# EasyEDA Pro project ProPrj_辉光管_2024.2.16_2024-11-09.epro, board PCB1
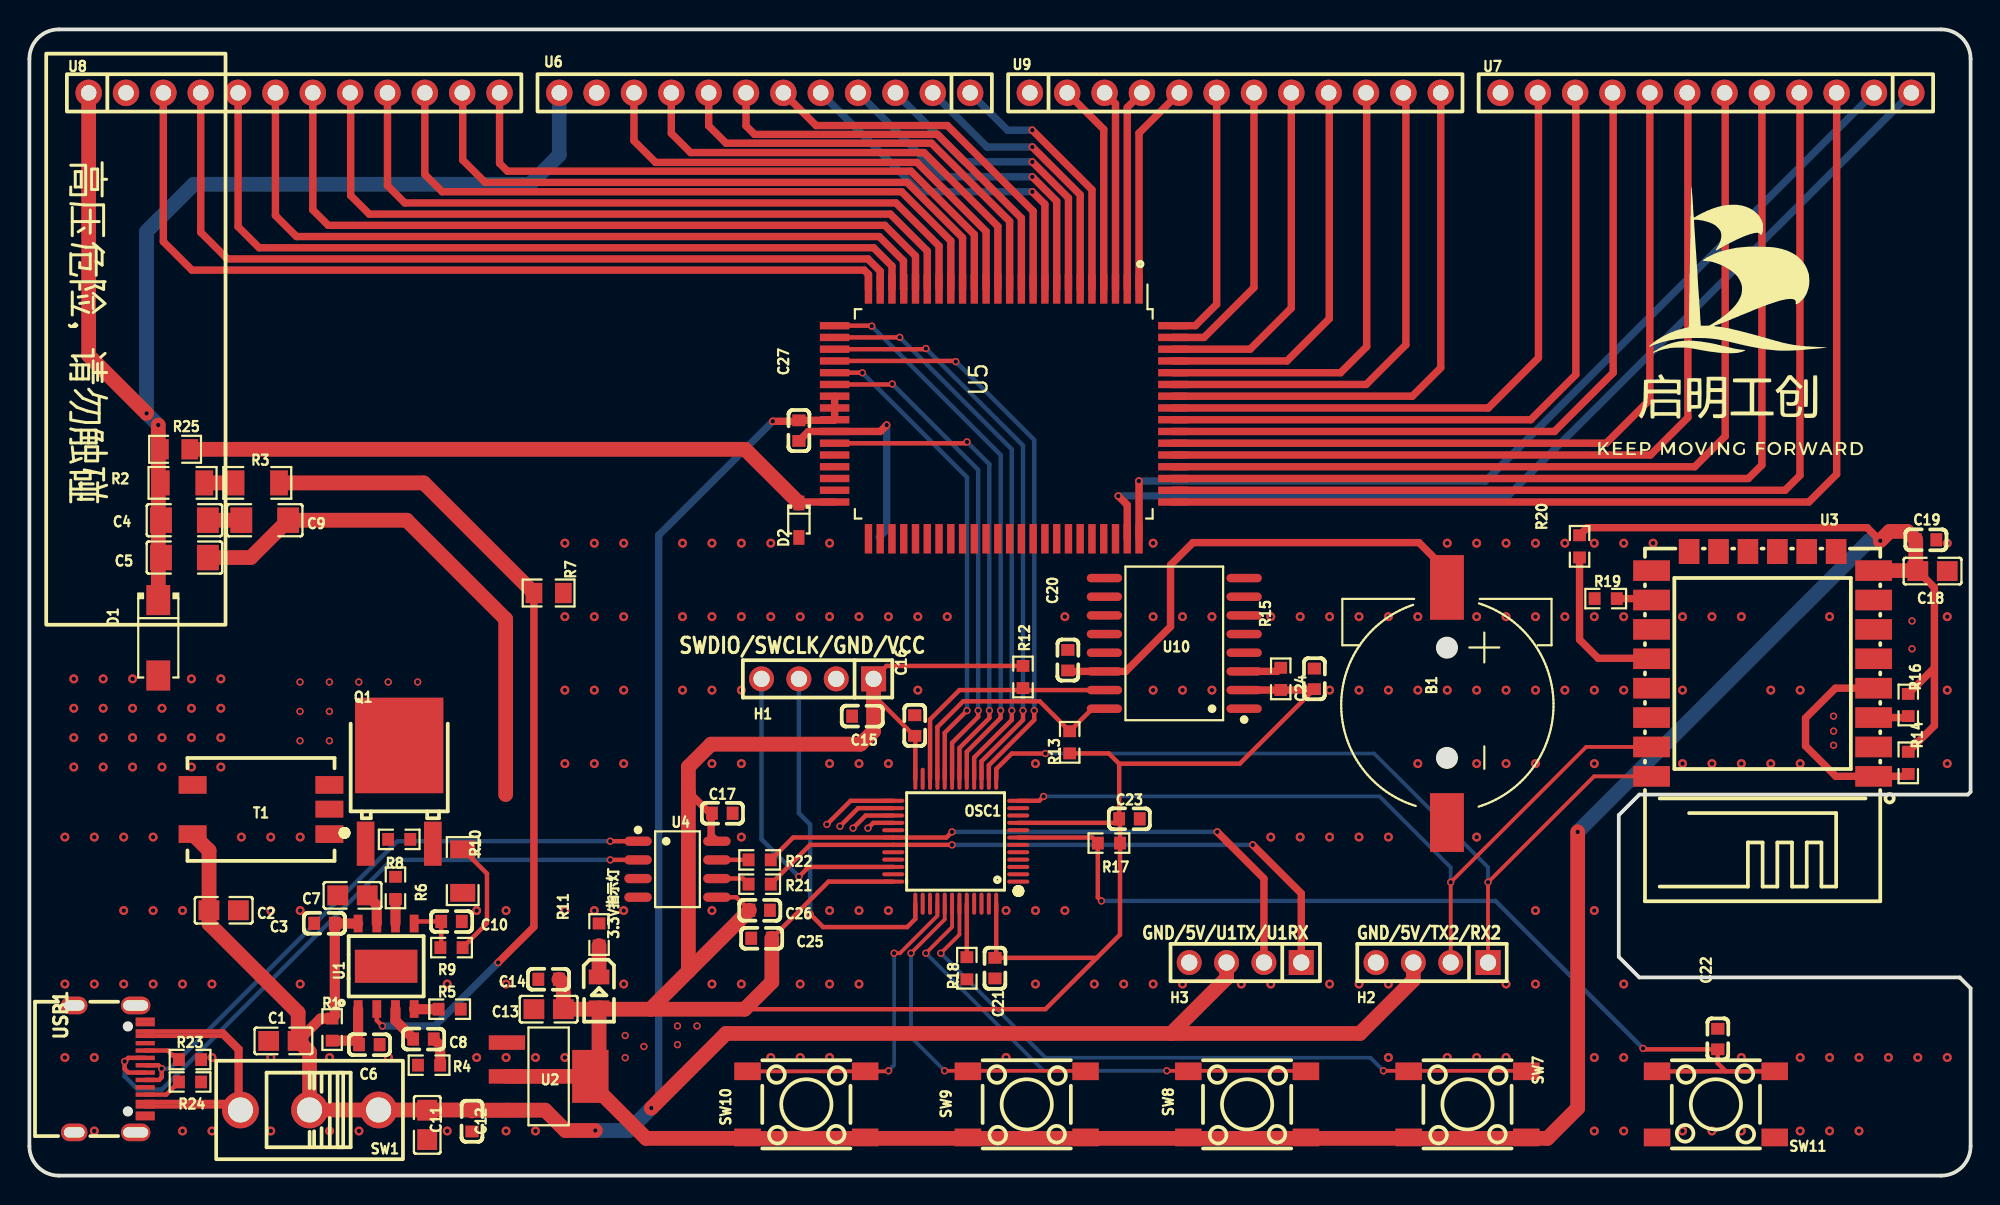
[diagram p0: board, top side]
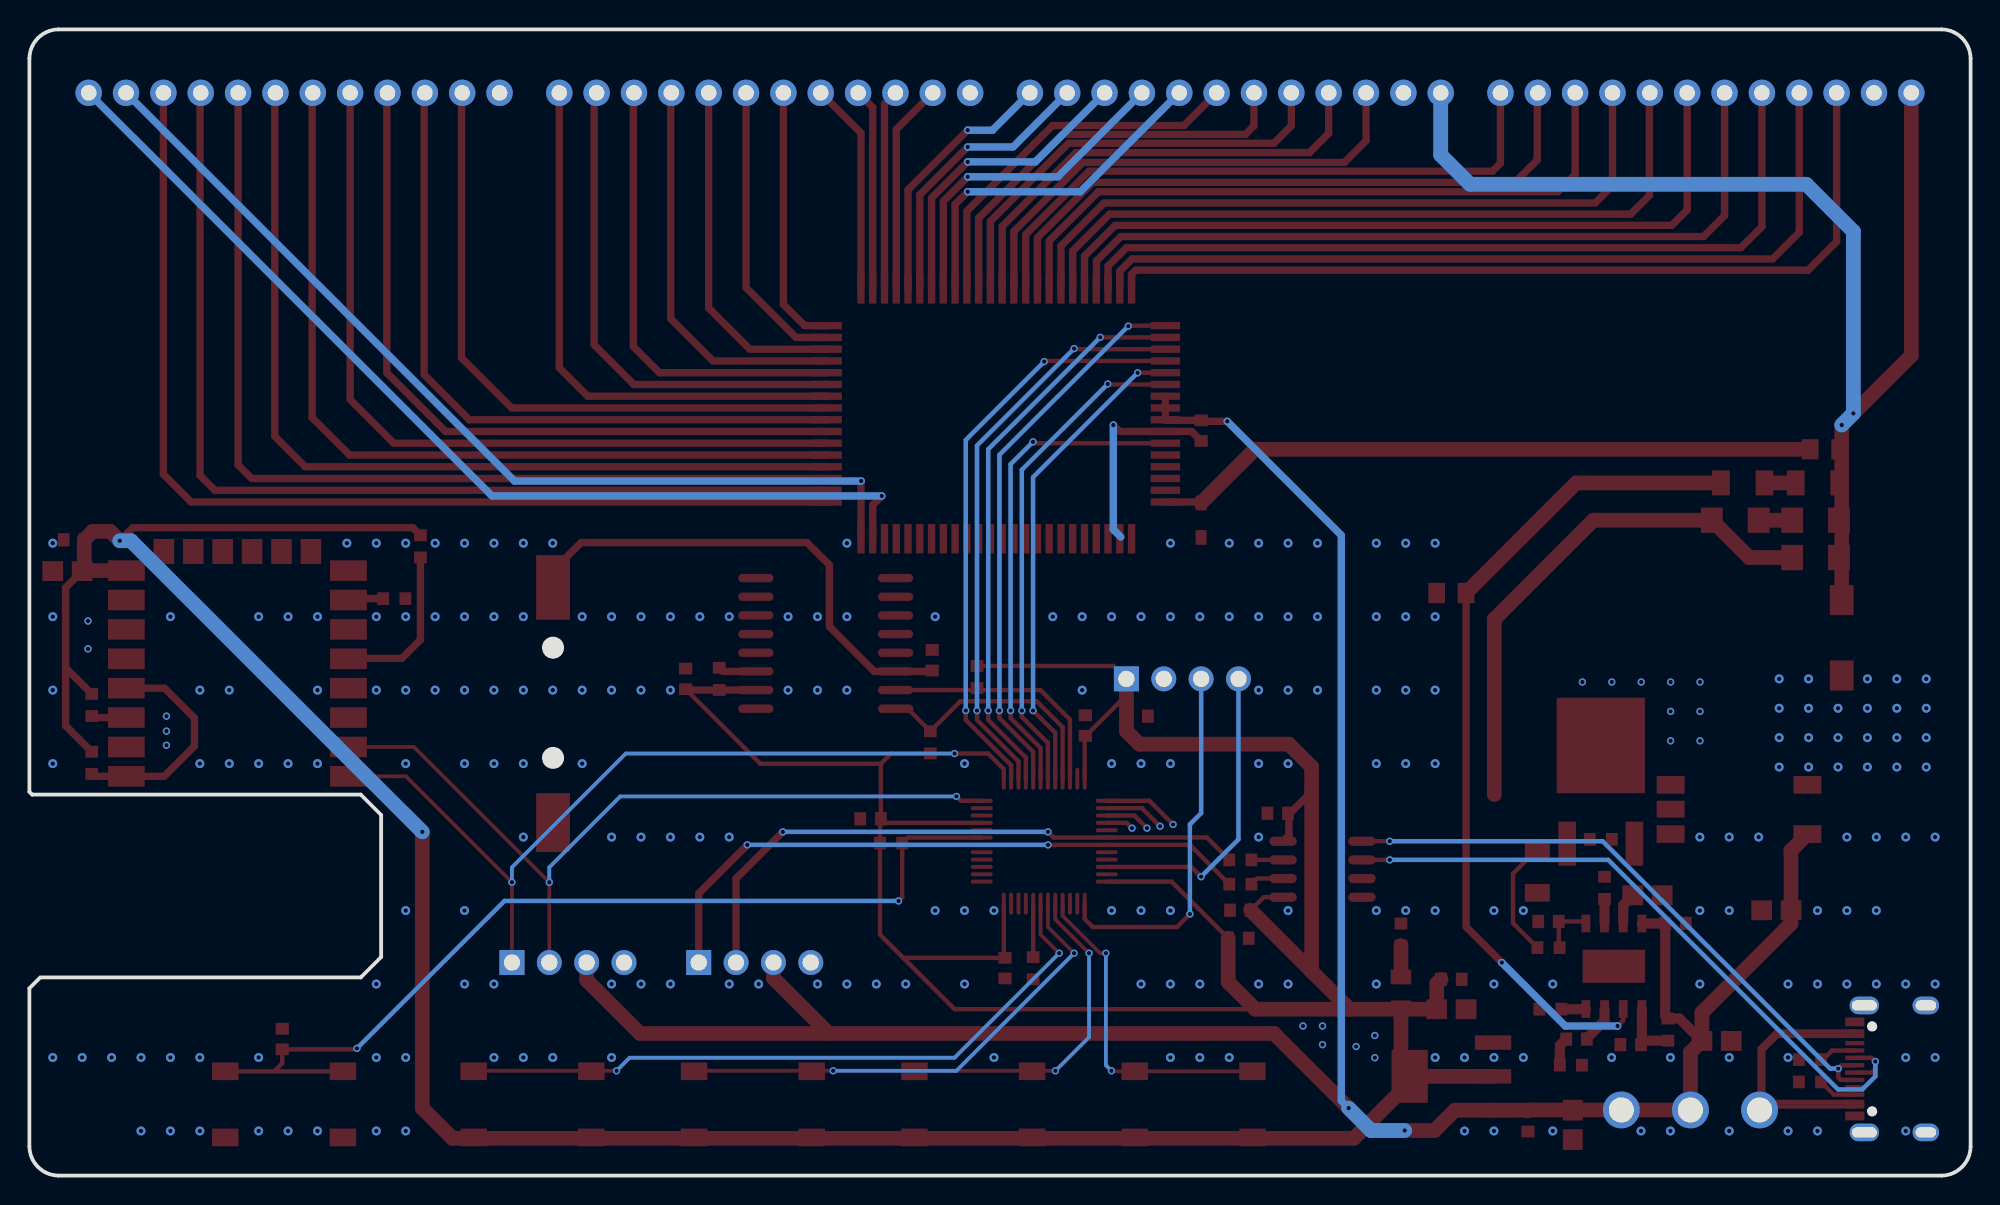
[diagram p1: board, bottom side, seen from below]

Outline 132 x 78 mm; copper layers: Top Layer, Bottom Layer. Coordinates in mm from the lower left corner of the outline.
Outline path: 0,76 0,2 arc(0.59,0.59) 2,0 130,0 arc(131.41,0.59) 132,2 132,12.75 131.26,13.48 109.47,13.48 108.08,14.88 108.08,24.53 109.47,25.93 131.82,25.93 132,26.11 132,76 arc(131.41,77.41) 130,78 2,78 arc(0.59,77.41) 0,76
Stack: Top Layer 0.035mm / Dielectric1 1.51mm FR4 er 4.5 / Bottom Layer 0.035mm

## Design rules (mm)
template: 自定义配置
spacing copperThickness1oz (default): track to track 0.102, other pairs 0.152 to 0.3
spacing copperThickness2oz: track to track 0.203, other pairs 0.152 to 0.3
track width copperThickness1oz (default): min 0.127, default 0.254, max 2.54
track width copperThickness2oz: min 0.203, default 0.254, max 2.54
differential pair differentialPair (default): width min 0.127, default 0.254, max 2.54; gap min 0.152, default 0.152
via viaSize (default): diameter min 0.5, default 0.61, max 10; hole min 0.3, default 0.305, max 6.3

## Placement (name value [footprint] x y rotation side)
3.3V指示灯  NCD0805R1  [LED0805-R-RD]  38.73 12.47 270 top
B1  CR1220-2  [BAT-SMD_CR1220-2]  96.39 32.03 270 top
C1  10uF  [C0805]  17.27 9.17 0 top
C2  10uF  [C0805]  13.21 18.06 180 top
C3  100nF  [C0603]  20.07 17.17 0 top
C4  1uF  [C1206]  10.54 44.6 180 top
C5  100nF  [C1206]  10.54 42.06 180 top
C6  100nF  [C0603]  23.11 8.91 180 top
C7  10uF  [C0805]  21.97 19.07 180 top
C8  10nF  [C0603]  26.8 9.29 180 top
C9  1uF  [C1206]  16 44.6 180 top
C10  100nF  [C0603]  28.7 17.29 180 top
C11  10uF  [C0805]  27.05 3.45 90 top
C12  100nF  [C0603]  30.1 3.71 90 top
C13  10uF  [C0805]  35.31 11.32 0 top
C14  100nF  [C0603]  35.31 13.36 0 top
C15  100nF  [C0603]  56.64 31.26 0 top
C16  100nF  [C0603]  60.2 30.63 270 top
C17  100nF  [C0603]  47.12 24.66 180 top
C18  10uF  [C0805]  129.41 41.14 180 top
C19  100nF  [C0603]  128.97 43.26 0 top
C20  100nF  [C0603]  70.61 35.07 270 top
C21  100nF  [C0603]  65.66 14.12 90 top
C22  1uF  [C0603]  114.81 9.29 270 top
C23  100nF  [C0603]  74.8 24.28 0 top
C24  100nF  [C0603]  87.38 33.8 270 top
C25  100nF  [C0603]  49.78 16.15 180 top
C26  100nF  [C0603]  49.66 18.06 180 top
C27  100nF  [C0603]  52.32 50.69 270 top
D1  ES1J  [SMA_L4.4-W2.8-LS5.4-RD]  8.76 36.6 270 top
D2  MM3Z68  [SOD-323_L1.8-W1.3-LS2.5-RD-1]  52.32 44.6 270 top
H1  PZ254V-11-04P  [HDR-TH_4P-P2.54-V-M]  53.59 33.8 180 top
H2  PZ254V-11-04P  [HDR-TH_4P-P2.54-V-M]  95.38 14.5 180 top
H3  PZ254V-11-04P  [HDR-TH_4P-P2.54-V-M]  82.68 14.5 180 top
OSC1  STM32F103C8T6TR  [LQFP-48_L7.0-W7.0-P0.50-LS9.0-BL]  62.99 22.75 90 top
Q1  NCEP02515K  [TO-252-3_L6.6-W6.1-P4.58-LS10.1-BR-2]  25.15 25.93 270 top
R1  10kΩ  [R0603]  20.58 9.94 90 top
R2  100kΩ  [R1206]  10.41 47.14 0 top
R3  100kΩ  [R1206]  15.49 47.14 0 top
R4  10kΩ  [R0603]  27.18 7.51 0 top
R5  20kΩ  [R0603]  28.58 11.32 180 top
R6  0Ω  [R0603]  24.89 19.58 90 top
R7  1.5kΩ  [R0805]  35.31 39.65 180 top
R8  10kΩ  [R0603]  25.15 22.88 180 top
R9  20Ω  [R0603]  28.7 15.52 0 top
R10  100mΩ  [R1206]  29.46 20.72 90 top
R11  1kΩ  [R0603]  38.73 16.41 270 top
R12  10kΩ  [R0603]  67.56 33.93 90 top
R13  10kΩ  [R0603]  70.74 29.49 270 top
R14  10kΩ  [R0603]  127.76 28.09 90 top
R15  10kΩ  [R0603]  85.09 33.8 90 top
R16  10kΩ  [R0603]  127.76 32.03 90 top
R17  10kΩ  [R0603]  73.41 22.63 180 top
R18  10kΩ  [R0603]  63.75 14.11 90 top
R19  10kΩ  [R0603]  107.19 39.27 180 top
R20  10kΩ  [R0603]  105.41 42.82 270 top
R21  0Ω  [R0603]  49.66 19.83 0 top
R22  0Ω  [R0603]  49.66 21.48 0 top
R23  1kΩ  [R0603]  10.92 7.9 0 top
R24  1kΩ  [R0603]  10.92 6.37 0 top
R25  240kΩ  [R0805]  9.91 49.42 180 top
SW1  SS-12D10L3  [SW-TH_SS-12D10L3]  19.05 4.47 180 top
SW7  TS-1102S-B-A-B  [SW-SMD_4P-L6.0-W6.0-P4.50-LS8.6]  97.79 4.85 0 top
SW8  TS-1102S-B-A-B  [SW-SMD_4P-L6.0-W6.0-P4.50-LS8.6]  82.8 4.85 0 top
SW9  TS-1102S-B-A-B  [SW-SMD_4P-L6.0-W6.0-P4.50-LS8.6]  67.82 4.85 0 top
SW10  TS-1102S-B-A-B  [SW-SMD_4P-L6.0-W6.0-P4.50-LS8.6]  52.83 4.85 0 top
SW11  TS-1102S-B-A-B  [SW-SMD_4P-L6.0-W6.0-P4.50-LS8.6]  114.68 4.85 180 top
T1  TTRN-060S-013-T  [TTRN-060S-013]  15.75 24.91 90 top
U1  -  [ESOP-8_L4.9-W3.9-P1.27-LS6.0-BL-EP4.2]  24.26 14.25 0 top
U2  AMS1117-3.3  [SOT-223-4_L6.5-W3.5-P2.30-LS7.0-BR]  35.31 6.75 180 top
U3  2.4GHz  [WIFIM-SMD_ESP-12F-ESP8266MOD]  117.86 34.82 90 top
U4  CH340N  [SOP-8_L4.9-W3.9-P1.27-LS6.0-BL]  44.07 20.85 270 top
U5  HV57708  [PQFP-80_L20.0-W14.0-P0.80-LS23.2-BL]  66.25 51.84 180 top
U6  KH-2.54FH-1X12P-H8.5  [HDR-TH_12P-P2.54-V-F]  50 73.68 180 top
U7  KH-2.54FH-1X12P-H8.5  [HDR-TH_12P-P2.54-V-F]  114 73.68 180 top
U8  KH-2.54FH-1X12P-H8.5  [HDR-TH_12P-P2.54-V-F]  18 73.68 0 top
U9  KH-2.54FH-1X12P-H8.5  [HDR-TH_12P-P2.54-V-F]  82 73.68 0 top
U10  DS3231SN#T&R  [SOIC-16_L10.3-W7.5-P1.27-LS10.3-BL]  77.85 36.22 90 top
USB1  KH-TYPE-C-16P  [USB-C-SMD_KH-TYPE-C-16P]  5.46 7.26 270 top

## Footprints (pads in the part's own frame, mm; a bottom-side part is the same pattern mirrored in y, then rotated)
BAT-SMD_CR1220-2
  rect 4.4x2.3 smd: 1(-8,0)
  rect 4x2.3 smd: 2(8,0)
C0603
  rect 0.8x0.9 smd: 1(-0.7,0) 2(0.7,0)
C0805
  rect 1.41x1.35 smd: 1(-1,0) 2(1,0)
C1206
  rect 1.485x1.728 smd: 1(-1.593,0) 2(1.593,0)
ESOP-8_L4.9-W3.9-P1.27-LS6.0-BL-EP4.2
  rect 0.6x1.2 smd: 1(-1.905,-2.909) 2(-0.635,-2.909) 3(0.635,-2.909) 4(1.905,-2.909) 5(1.905,2.909) 6(0.635,2.909) 7(-0.635,2.909) 8(-1.905,2.909)
  rect 4.25x2.25 smd: 9(0,0)
HDR-TH_4P-P2.54-V-M
  rect 1.7x1.7 hole 1.1: 1(-3.81,0)
  round 1.7 hole 1.1: 2(-1.27,0) 3(1.27,0) 4(3.81,0)
HDR-TH_12P-P2.54-V-F
  round 1.8 hole 1.05: 1(-13.97,0) 2(-11.43,0) 3(-8.89,0) 4(-6.35,0) 5(-3.81,0) 6(-1.27,0) 7(1.27,0) 8(3.81,0) 9(6.35,0) 10(8.89,0) 11(11.43,0) 12(13.97,0)
LED0805-R-RD
  rect 1x1.399 smd: 1(1.05,0) 2(-1.05,0)
LQFP-48_L7.0-W7.0-P0.50-LS9.0-BL
  oval 0.27x1.5 smd: 1(-2.75,-4.25) 2(-2.25,-4.25) 3(-1.75,-4.25) 4(-1.25,-4.25) 5(-0.75,-4.25) 6(-0.25,-4.25) 7(0.25,-4.25) 8(0.75,-4.25) 9(1.25,-4.25) 10(1.75,-4.25) 11(2.25,-4.25) 12(2.75,-4.25) 25(2.75,4.25) 26(2.25,4.25) 27(1.75,4.25) 28(1.25,4.25) 29(0.75,4.25) 30(0.25,4.25) 31(-0.25,4.25) 32(-0.75,4.25) 33(-1.25,4.25) 34(-1.75,4.25) 35(-2.25,4.25) 36(-2.75,4.25)
  oval 1.5x0.27 smd: 13(4.25,-2.75) 14(4.25,-2.25) 15(4.25,-1.75) 16(4.25,-1.25) 17(4.25,-0.75) 18(4.25,-0.25) 19(4.25,0.25) 20(4.25,0.75) 21(4.25,1.25) 22(4.25,1.75) 23(4.25,2.25) 24(4.25,2.75) 37(-4.25,2.75) 38(-4.25,2.25) 39(-4.25,1.75) 40(-4.25,1.25) 41(-4.25,0.75) 42(-4.25,0.25) 43(-4.25,-0.25) 44(-4.25,-0.75) 45(-4.25,-1.25) 46(-4.25,-1.75) 47(-4.25,-2.25) 48(-4.25,-2.75)
PQFP-80_L20.0-W14.0-P0.80-LS23.2-BL
  rect 0.5x2 smd: 1(-9.2,-8.5) 2(-8.4,-8.5) 3(-7.6,-8.5) 4(-6.8,-8.5) 5(-6,-8.5) 6(-5.2,-8.5) 7(-4.4,-8.5) 8(-3.6,-8.5) 9(-2.8,-8.5) 10(-2,-8.5) 11(-1.2,-8.5) 12(-0.4,-8.5) 13(0.4,-8.5) 14(1.2,-8.5) 15(2,-8.5) 16(2.8,-8.5) 17(3.6,-8.5) 18(4.4,-8.5) 19(5.2,-8.5) 20(6,-8.5) 21(6.8,-8.5) 22(7.6,-8.5) 23(8.4,-8.5) 24(9.2,-8.5) 41(9.2,8.5) 42(8.4,8.5) 43(7.6,8.5) 44(6.8,8.5) 45(6,8.5) 46(5.2,8.5) 47(4.4,8.5) 48(3.6,8.5) 49(2.8,8.5) 50(2,8.5) 51(1.2,8.5) 52(0.4,8.5) 53(-0.4,8.5) 54(-1.2,8.5) 55(-2,8.5) 56(-2.8,8.5) 57(-3.6,8.5) 58(-4.4,8.5) 59(-5.2,8.5) 60(-6,8.5) 61(-6.8,8.5) 62(-7.6,8.5) 63(-8.4,8.5) 64(-9.2,8.5)
  rect 2x0.5 smd: 25(11.5,-6) 26(11.5,-5.2) 27(11.5,-4.4) 28(11.5,-3.6) 29(11.5,-2.8) 30(11.5,-2) 31(11.5,-1.2) 32(11.5,-0.4) 33(11.5,0.4) 34(11.5,1.2) 35(11.5,2) 36(11.5,2.8) 37(11.5,3.6) 38(11.5,4.4) 39(11.5,5.2) 40(11.5,6) 65(-11.5,6) 66(-11.5,5.2) 67(-11.5,4.4) 68(-11.5,3.6) 69(-11.5,2.8) 70(-11.5,2) 71(-11.5,1.2) 72(-11.5,0.4) 73(-11.5,-0.4) 74(-11.5,-1.2) 75(-11.5,-2) 76(-11.5,-2.8) 77(-11.5,-3.6) 78(-11.5,-4.4) 79(-11.5,-5.2) 80(-11.5,-6)
R0603
  rect 0.806x0.864 smd: 1(-0.753,0) 2(0.753,0)
R0805
  rect 1.133x1.377 smd: 1(-1,0) 2(1,0)
R1206
  rect 1.208x1.701 smd: 1(-1.479,0) 2(1.479,0)
SMA_L4.4-W2.8-LS5.4-RD
  rect 2.046x1.62 smd: 1(-2.566,0) 2(2.566,0)
SOD-323_L1.8-W1.3-LS2.5-RD-1
  rect 1x0.75 smd: 1(-1.173,0) 2(1.173,0)
SOIC-16_L10.3-W7.5-P1.27-LS10.3-BL
  oval 0.574x2.401 smd: 1(-4.445,-4.75) 2(-3.175,-4.75) 3(-1.905,-4.75) 4(-0.635,-4.75) 5(0.635,-4.75) 6(1.905,-4.75) 7(3.175,-4.75) 8(4.445,-4.75) 9(4.445,4.75) 10(3.175,4.75) 11(1.905,4.75) 12(0.635,4.75) 13(-0.635,4.75) 14(-1.905,4.75) 15(-3.175,4.75) 16(-4.445,4.75)
SOP-8_L4.9-W3.9-P1.27-LS6.0-BL
  oval 0.63x1.865 smd: 1(-1.905,-2.683) 2(-0.635,-2.683) 3(0.635,-2.683) 4(1.905,-2.683) 5(1.905,2.683) 6(0.635,2.683) 7(-0.635,2.683) 8(-1.905,2.683)
SOT-223-4_L6.5-W3.5-P2.30-LS7.0-BR
  rect 2.47x0.98 smd: 1(2.835,-2.3) 2(2.835,0) 3(2.835,2.3)
  rect 2.47x3.6 smd: 4(-2.835,0)
SW-SMD_4P-L6.0-W6.0-P4.50-LS8.6
  rect 1.8x1.2 smd: 1(-4,2.25) 2(4,2.25) 3(-4,-2.25) 4(4,-2.25)
SW-TH_SS-12D10L3
  round 2.5 hole 1.7: 1(-4.7,0) 2(0,0) 3(4.7,0)
TO-252-3_L6.6-W6.1-P4.58-LS10.1-BR-2
  rect 3x1.2 smd: 1(3.342,-2.285) 3(3.342,2.285)
  rect 6.5x6 smd: 2(-3.342,0)
TTRN-060S-013
  rect 1.2x1.9 smd: 1(-1.675,4.65) 2(1.675,4.651) 3(-1.675,-4.65) 5(1.675,-4.651)
  rect 1.15x1.9 smd: EMPTY(0.025,-4.65)
USB-C-SMD_KH-TYPE-C-16P
  oval 1.2x2 hole 0.7x1.7: 1(-4.32,1.765) 2(4.32,1.765)
  oval 1.2x1.8 hole 0.7x1.4: 3(-4.32,-2.415) 4(4.32,-2.415)
  rect 0.3x1.3 smd: A1(-3.35,2.415) A4(-2.55,2.415) A5(-1.25,2.415) A6(-0.25,2.415) A7(0.25,2.415) A8(1.25,2.415) A9(2.55,2.415) A12(3.35,2.415) B1(3.05,2.415) B4(2.25,2.415) B5(1.75,2.415) B6(0.75,2.415) B7(-0.75,2.415) B8(-1.75,2.415) B9(-2.25,2.415) B12(-3.05,2.415)
WIFIM-SMD_ESP-12F-ESP8266MOD
  rect 1.4x2.5 smd: 1(-7.651,-7.551) 2(-5.651,-7.551) 3(-3.651,-7.551) 4(-1.651,-7.551) 5(0.349,-7.551) 6(2.349,-7.551) 7(4.349,-7.551) 8(6.349,-7.551) 9(6.349,7.548) 10(4.349,7.55) 11(2.349,7.551) 12(0.349,7.551) 13(-1.651,7.55) 14(-3.651,7.551) 15(-5.651,7.551) 16(-7.651,7.551)
  rect 1.7x1.4 smd: 17(7.651,-5) 18(7.649,-3.002) 19(7.649,-1.004) 20(7.649,0.998) 21(7.649,2.997) 22(7.651,4.997)

## Nets
GND: B1.2 C1.1 C2.1 C3.1 C5.1 C6.1 C7.2 C9.1 C10.1 C11.1 C12.1 C13.1 C14.1 C15.1 C16.1 C17.1 C18.1 C19.2 C20.1 C21.1 C22.1 C23.2 C24.1 C25.2 C26.1 C27.2 D2.2 H1.2 H2.4 H3.4 OSC1.8 OSC1.23 OSC1.35 OSC1.47 R4.1 R5.1 R7.1 R10.1 R11.1 R18.1 R19.2 R23.2 R24.2 SW11.1 SW11.2 T1.3 U1.9 U2.1 U3.9 U4.3 U5.34 U10.13 USB1.1 USB1.2 USB1.3 USB1.4 USB1.A1 USB1.A12 USB1.B1 USB1.B12
VCC: 3.3V指示灯.1 C13.2 C14.2 C15.2 C16.2 C17.2 C18.2 C19.1 C21.2 C23.1 C24.2 C25.1 C26.2 H1.1 OSC1.9 OSC1.24 OSC1.36 OSC1.48 R12.2 R13.2 R14.2 R15.1 R16.2 R17.1 R20.1 SW7.3 SW7.4 SW8.3 SW8.4 SW9.3 SW9.4 SW10.3 SW10.4 U2.2 U2.4 U3.8 U4.5 U4.8 U10.2
VIN: C1.2 C2.2 C3.2 C11.2 C12.2 C27.1 H2.3 H3.3 R1.2 SW1.1 SW1.2 T1.1 U1.8 U2.3 U5.31 U5.32 U5.33
BOOT0: OSC1.44 R18.2
DS_SCL: OSC1.21 R13.1 U10.16
DS_SDA: OSC1.22 R12.1 U10.15
ESP_RST: R14.1 U3.1 U3.4
FB: R3.2 R7.2 U1.2
G1_0: U5.24 U8.3
G1_1: U5.23 U8.4
G1_2: U5.22 U8.5
G1_3: U5.21 U8.6
G1_4: U5.20 U8.7
G1_5: U5.19 U8.8
G1_6: U5.18 U8.9
G1_7: U5.17 U8.10
G1_8: U5.16 U8.11
G1_9: U5.15 U8.12
G2_0: U5.14 U6.10
G2_1: U5.13 U6.9
G2_2: U5.12 U6.8
G2_3: U5.11 U6.7
G2_4: U5.10 U6.6
G2_5: U5.9 U6.5
G2_6: U5.8 U6.4
G2_7: U5.7 U6.3
G2_8: U5.6 U6.2
G2_9: U5.5 U6.1
G3_0: U5.4 U9.2
G3_1: U5.3 U9.3
G3_2: U5.2 U9.4
G3_3: U5.1 U9.5
G3_4: U5.80 U9.6
G3_5: U5.79 U9.7
G3_6: U5.78 U9.8
G3_7: U5.77 U9.9
G3_8: U5.76 U9.10
G3_9: U5.75 U9.11
G4_0: U5.72 U7.10
G4_1: U5.71 U7.9
G4_2: U5.70 U7.8
G4_3: U5.69 U7.7
G4_4: U5.68 U7.6
G4_5: U5.67 U7.5
G4_6: U5.66 U7.4
G4_7: U5.65 U7.3
G4_8: U5.64 U7.2
G4_9: U5.63 U7.1
HGD_1: U5.74 U9.12
HGD_2: U5.73 U7.11
HV: C4.2 C5.2 D1.1 R2.1 R25.2 U6.12 U8.1
HV_CLK: OSC1.19 U5.30
HV_DIN1: OSC1.14 U5.28
HV_DIN2: OSC1.15 U5.27
HV_DIN3: OSC1.16 U5.26
HV_DIN4: OSC1.17 U5.25
HV_LE: OSC1.20 U5.29
HV_POL: OSC1.18 U5.35
NRST: C22.2 OSC1.7 R17.2 SW11.3 SW11.4
PA0: OSC1.10
PA1: OSC1.11
PA2/U2TX: H2.2 OSC1.12 U3.15
PA3/U2RX: H2.1 OSC1.13 U3.16
PA8: OSC1.29
PA9/U1TX: H3.2 OSC1.30 R22.2
PA10/U1RX: H3.1 OSC1.31 R21.2
PA11: OSC1.32
PA12: OSC1.33
PA15: OSC1.38
PB3: OSC1.39
PB4: OSC1.40 SW10.1 SW10.2
PB5: OSC1.41 SW9.1 SW9.2
PB6: OSC1.42 SW8.1 SW8.2
PB7: OSC1.43 SW7.1 SW7.2
PB8: OSC1.45
PB9: OSC1.46
PB12: OSC1.25
PB13: OSC1.26
PB14: OSC1.27
PB15: OSC1.28
PC13: OSC1.2
SWCLK: H1.3 OSC1.37
SWDIO: H1.4 OSC1.34
USB1CC1: R23.1 USB1.A5
USB1CC2: R24.1 USB1.B5
USB1D+: U4.1 USB1.A6 USB1.B6
USB1D-: U4.2 USB1.A7 USB1.B7
VIPN: SW1.3 USB1.A4 USB1.A9 USB1.B4 USB1.B9
$2N14740: 3.3V指示灯.2 R11.2
$2N61129: C6.2 R1.1 U1.1
$2N61132: C8.2 U1.3
$2N61133: C8.1 R4.2
$2N61134: R5.2 U1.4
$2N61136: C7.1 U1.7
$2N61143: C10.2 R9.1 U1.5
$2N61144: R6.1 U1.6
$2N61145: Q1.1 R6.2 R8.2
$2N61146: R2.2 R3.1
$2N61148: Q1.3 R8.1 R9.2 R10.2
$2N61152: D1.2 T1.2
$2N61153: Q1.2 T1.5
$2N62507: C4.1 C9.2
$4N23212: R15.2 U10.3
$4N37986: R22.1 U4.7
$4N37987: R21.1 U4.6
$4N48239: B1.1 C20.2 U10.14
$4N60541: R16.1 U3.3
$4N60605: R19.1 U3.10
$4N60656: R20.2 U3.12
$7N2158: D2.1 R25.1 U5.40

Pads without a net: OSC1 1 3 4 5 6; T1 EMPTY; U3 2 5 6 7 11 13 14 17 18 19 20 21 22; U4 4; U5 36 37 38 39 41 42 43 44 45 46 47 48 49 50 51 52 53 54 55 56 57 58 59 60 61 62; U6 11; U7 12; U8 2; U9 1; U10 1 4 5 6 7 8 9 10 11 12; USB1 A8 B8

## Via types
v1: diameter 0.5, hole 0.3, Top Layer to Bottom Layer, 79 vias
v2: diameter 0.61, hole 0.304, Top Layer to Bottom Layer, 225 vias

## Routing (per net, layer and track width the routed paths; a pad name or vN(x,y) marks a point on that pad's centre or on a via; arc(x,y) is an arc through that point)
GND: length 50.3
  Top Layer w0.5: 52.32,50 52.97,50.64 U5.34 57.85,50.64 v1(58.29,51.08)
  Top Layer w1: 32.39,25.93 32.39,37.87 25.65,44.6 C9.1 15.05,42.06 C5.1
  Bottom Layer w0.5: v1(58.29,51.08) 58.29,43.96 57.78,43.46
  vias: v1(40.51,9.53) v1(40.51,8.02) v1(41.78,8.78) v1(44.07,10.18) v1(44.07,8.91) v1(45.4,10.18) v1(122.68,31.26) v1(122.68,30.25) v1(122.68,29.28) v1(128.02,37.74) v1(128.02,35.85) v2(2.41,23.04) v2(2.41,13.04) v2(2.41,8.04) v2(4.41,23.04) v2(4.41,13.04) v2(4.41,8.04) v2(4.41,3.04) v2(6.41,23.04) v2(6.41,18.04) v2(6.41,13.04) v2(8.41,23.04) v2(8.41,18.04) v2(8.41,13.04) v2(10.41,18.04) v2(10.41,13.04) v2(10.41,3.04) v2(12.41,13.04) v2(12.41,8.04) v2(12.41,3.04) v2(14.41,23.04) v2(16.41,23.04) v2(16.41,18.04) v2(16.41,8.04) v2(16.41,3.04) v2(18.41,23.04) v2(18.41,18.04) v2(18.41,13.04) v2(20.41,8.04) v2(20.41,3.04) v2(22.41,3.04) v2(24.41,8.04) v2(28.41,13.04) v2(28.41,3.04) v2(30.41,18.04) v2(30.41,8.04) v2(32.41,18.04) v2(32.41,13.04) v2(32.41,8.04) v2(32.41,3.04) v2(34.41,8.04) v2(34.41,3.04) v2(36.41,43.04) v2(36.41,38.04) v2(36.41,33.04) v2(36.41,28.04) v2(36.41,18.04) v2(36.41,8.04) v2(38.41,43.04) v2(38.41,38.04) v2(38.41,33.04) v2(38.41,28.04) v2(38.41,18.04) v2(40.41,43.04) v2(40.41,38.04) v2(40.41,33.04) v2(40.41,28.04) v2(40.41,18.04) v2(40.41,13.04) v2(44.41,43.04) v2(44.41,38.04) v2(44.41,33.04) v2(46.41,43.04) v2(46.41,38.04) v2(46.41,33.04) v2(46.41,28.04) v2(46.41,18.04) v2(46.41,13.04) v2(48.41,43.04) v2(48.41,38.04) v2(48.41,33.04) v2(48.41,28.04) v2(48.41,23.04) v2(48.41,13.04) v2(50.41,43.04) v2(50.41,38.04) v2(50.41,8.04) v2(52.41,38.04) v2(52.41,13.04) v2(52.41,8.04) v2(54.41,43.04) v2(54.41,38.04) v2(54.41,28.04) v2(54.41,18.04) v2(54.41,13.04) v2(54.41,8.04) v2(56.41,38.04) v2(56.41,28.04) v2(56.41,18.04) v2(56.41,13.04) v2(58.41,38.04) v2(58.41,28.04) v2(58.41,18.04) v2(60.41,38.04) v2(60.41,33.04) v2(62.41,38.04) v2(66.41,18.04) v2(66.41,8.04) v2(68.41,28.04) v2(68.41,18.04) v2(68.41,13.04) v2(70.41,38.04) v2(70.41,18.04) v2(72.41,13.04) v2(74.41,13.04) v2(76.41,43.04) v2(76.41,38.04) v2(76.41,33.04) v2(76.41,13.04) v2(78.41,38.04) v2(78.41,33.04) v2(78.41,13.04) v2(80.41,38.04) v2(80.41,33.04) v2(82.41,13.04) v2(84.41,38.04) v2(84.41,23.04) v2(84.41,13.04) v2(86.41,38.04) v2(86.41,23.04) v2(88.41,38.04) v2(88.41,33.04) v2(88.41,23.04) v2(88.41,13.04) v2(90.41,38.04) v2(90.41,33.04) v2(90.41,23.04) v2(90.41,13.04) v2(92.41,38.04) v2(92.41,33.04) v2(92.41,23.04) v2(92.41,13.04) v2(92.41,8.04) v2(94.41,38.04) v2(94.41,33.04) v2(94.41,28.04) v2(96.41,43.04) v2(96.41,33.04) v2(96.41,8.04) v2(98.41,43.04) v2(98.41,38.04) v2(98.41,33.04) v2(98.41,28.04) v2(98.41,23.04) v2(98.41,8.04) v2(100.41,43.04) v2(100.41,38.04) v2(100.41,33.04) v2(100.41,28.04) v2(100.41,13.04) v2(100.41,8.04) v2(102.41,43.04) v2(102.41,38.04) v2(102.41,33.04) v2(102.41,28.04) v2(102.41,18.04) v2(102.41,13.04) v2(104.41,43.04) v2(104.41,38.04) v2(104.41,33.04) v2(106.41,43.04) v2(106.41,38.04) v2(106.41,33.04) v2(106.41,28.04) v2(106.41,18.04) v2(106.41,8.04) v2(106.41,3.04) v2(108.41,43.04) v2(108.41,38.04) v2(108.41,33.04) v2(108.41,13.04) v2(108.41,8.04) v2(108.41,3.04) v2(110.41,43.04) v2(112.41,38.04) v2(112.41,33.04) v2(112.41,28.04) v2(112.41,3.04) v2(114.41,38.04) v2(114.41,28.04) v2(114.41,3.04) v2(116.41,38.04) v2(116.41,28.04) v2(116.41,8.04) v2(116.41,3.04) v2(118.41,33.04) v2(118.41,28.04) v2(120.41,33.04) v2(120.41,28.04) v2(120.41,8.04) v2(120.41,3.04) v2(122.41,38.04) v2(122.41,8.04) v2(122.41,3.04) v2(124.41,8.04) v2(124.41,3.04) v2(126.41,8.04) v2(128.41,8.04) v2(130.41,43.04) v2(130.41,38.04) v2(130.41,33.04) v2(130.41,28.04) v2(130.41,8.04)
VCC: length 348.5
  Top Layer w0.3: 74.16,24.08 74.16,24.22 C23.1 74.1,28.03 ; 74.16,24.08 74.08,24 OSC1.9 ; 74.16,24.08 R17.1 74.16,16.4 72.58,14.82 ; 72.58,14.82 C21.2 65.74,14.9 OSC1.48 ; 72.58,14.82 69.09,11.32 48.64,11.32 ; R13.2 73.4,28.73 74.1,28.03 ; OSC1.36 54.34,20 C25.1 ; R12.2 58.28,34.68 H1.1 ; 48.96,18.06 48.07,18.94 U4.5 ; OSC1.24 60.24,29.85 57.83,32.26 57.4,32.26 ; 74.1,28.03 82.3,28.03 87.31,33.04
  Top Layer w0.5: R14.2 129.54,30.62 129.54,34.56 ; 129.54,34.56 R16.2 ; 129.54,34.56 129.54,40.01 C18.2 ; 44.81,26.12 46.36,24.58 46.36,23.15 U4.8 ; v1(125.86,43.2) 124.97,44.09 105.93,44.09 R20.1 ; U10.2 87.31,33.04 C24.2
  Top Layer w1: U2.4 38.73,7.35 38.73,11.32 ; U2.4 U2.2 ; U2.4 38.14,6.33 41.94,2.54 101.73,2.54 ; 128.38,41.17 128.27,41.28 C19.1 127.7,43.84 126.49,43.84 v1(125.86,43.2) ; 128.38,41.17 C18.2 ; 128.38,41.17 U3.8 ; 42.23,11.32 38.73,11.32 ; 42.23,11.32 48.64,11.32 50.48,13.17 C25.1 ; 42.23,11.32 44.81,13.91 ; 38.73,11.32 38.64,11.32 ; 101.73,2.54 SW7.4 ; 101.73,2.54 103.22,2.54 105.28,4.59 v1(105.28,23.39) ; 38.64,11.32 C13.2 36.31,13.06 C14.2 ; 38.64,11.32 3.3V指示灯.1 ; 48.96,18.06 44.81,13.91 ; 44.81,13.91 44.81,27.81 46.36,29.36 56.51,29.36 57.4,30.25 H1.1
  Bottom Layer w1: v1(125.86,43.2) 125.09,43.2 v1(105.28,23.39)
VIN: length 176.7
  Top Layer w0.5: v1(50.55,51.33) 52.26,51.33 C27.1 54.71,51.39 U5.33 U5.32 U5.31
  Top Layer w0.69: U1.8 20.78,17.15 C3.2 20.77,10.87 R1.2 19.8,10.69 C1.2
  Top Layer w1: H2.3 94.11,13.3 90.48,9.67 77.64,9.67 ; 81.41,14.5 81.41,13.44 77.64,9.67 ; v1(42.29,4.59) 47.37,9.67 77.64,9.67 ; T1.1 12.22,22.12 12.22,17.14 18.27,11.09 C1.2 19.05,8.39 SW1.2 SW1.1 30.04,4.47 C12.2 30.15,4.45 U2.3 35.07,4.45 36.45,3.07 v1(38.48,3.07)
  Bottom Layer w0.5: v1(50.55,51.33) 42.79,43.58 42.79,5.09 v1(42.29,4.59)
  Bottom Layer w1: v1(38.48,3.07) 40.77,3.07 v1(42.29,4.59)
BOOT0: length 3.6
  Top Layer w0.3: R18.2 63.74,14.87 OSC1.44
DS_SCL: length 17.1
  Top Layer w0.3: U10.16 72.27,31.77 R13.1 68.7,32.28 63.5,32.28 61.74,30.52 OSC1.21
DS_SDA: length 16.7
  Top Layer w0.3: U10.15 63.25,33.04 61.24,31.04 OSC1.22
ESP_RST: length 15.3
  Top Layer w0.5: U3.4 122.81,33.17 120.78,31.14 120.78,29.23 122.84,27.17 U3.1 127.6,27.17 R14.1
FB: length 57.6
  Top Layer w0.3: v1(24,10.18) 23.62,10.56 U1.2
  Top Layer w0.5: v1(31.88,14.5) 34.31,16.93 R7.2
  Top Layer w1: R7.2 26.81,47.14 R3.2
  Bottom Layer w0.5: v1(24,10.18) 27.56,10.18 v1(31.88,14.5)
G1_0: length 60
  Top Layer w0.5: U5.24 57.05,61.33 56.77,61.62 11.05,61.62 9.11,63.56 U8.3
G1_1: length 58
  Top Layer w0.5: U8.4 11.65,64.19 13.46,62.38 57.02,62.38 57.85,61.55 U5.23
G1_2: length 56.2
  Top Layer w0.5: U5.22 58.65,61.89 57.4,63.14 15.62,63.14 14.19,64.57 U8.5
G1_3: length 54.3
  Top Layer w0.5: U5.21 59.44,60.36 59.44,62.25 57.78,63.9 18.16,63.9 16.73,65.33 U8.6
G1_4: length 52.5
  Top Layer w0.5: U8.7 19.27,65.72 20.32,64.67 58.17,64.67 60.25,62.58 U5.20
G1_5: length 50.4
  Top Layer w0.5: U8.8 21.84,73.65 21.84,66.7 23.11,65.43 58.55,65.43 61.05,62.92 U5.19
G1_6: length 48.4
  Top Layer w0.5: U8.9 24.35,67.37 25.53,66.19 58.93,66.19 61.85,63.26 U5.18
G1_7: length 46.5
  Top Layer w0.5: U8.10 26.89,68.13 28.07,66.95 59.31,66.95 62.65,63.61 U5.17
G1_8: length 44.3
  Top Layer w0.5: U8.11 29.46,73.65 29.46,69.11 30.99,67.59 59.69,67.59 63.45,63.82 U5.16
G1_9: length 42.8
  Top Layer w0.5: U5.15 64.25,64.04 59.94,68.35 32.51,68.35 31.97,68.89 U8.12
G2_0: length 33.7
  Top Layer w0.5: U5.14 65.05,64.25 60.36,68.95 42.58,68.95 41.11,70.42 U6.10
G2_1: length 31.8
  Top Layer w0.5: U5.13 65.85,64.6 60.83,69.62 44.96,69.62 43.65,70.93 U6.9
G2_2: length 30
  Top Layer w0.5: U5.12 66.65,64.94 61.34,70.25 47.37,70.25 46.19,71.43 U6.8
G2_3: length 28.4
  Top Layer w0.5: U6.7 48.73,71.43 49.31,70.86 61.75,70.86 67.45,65.16 U5.11
G2_4: length 25.6
  Top Layer w0.5: U6.6 53.5,71.46 62.42,71.46 68.25,65.63 U5.10
G2_5: length 24.1
  Top Layer w0.5: U5.9 69.05,66.1 v1(68.2,66.95)
  Bottom Layer w0.5: v1(68.2,66.95) 60.54,66.95 U6.5
G2_6: length 22.5
  Top Layer w0.5: U5.8 69.85,66.31 v1(68.2,67.97)
  Bottom Layer w0.5: U6.4 62.06,67.97 v1(68.2,67.97)
G2_7: length 20.9
  Top Layer w0.5: U5.7 70.65,66.53 v1(68.2,68.98)
  Bottom Layer w0.5: v1(68.2,68.98) 63.59,68.98 U6.3
G2_8: length 19.3
  Top Layer w0.5: U5.6 71.45,66.74 v1(68.2,70)
  Bottom Layer w0.5: U6.2 65.11,70 v1(68.2,70)
G2_9: length 17.8
  Top Layer w0.5: v1(68.2,71.14) 72.25,67.09 U5.5
  Bottom Layer w0.5: v1(68.2,71.14) 66.51,71.14 U6.1
G3_0: length 14.4
  Top Layer w0.5: U5.4 73.05,71.2 U9.2
G3_1: length 13.7
  Top Layer w0.5: U5.3 73.85,72.94 U9.3
G3_2: length 13.8
  Top Layer w0.5: U9.4 74.65,72.69 U5.2
G3_3: length 14.5
  Top Layer w0.5: U9.5 75.45,70.95 U5.1
G3_4: length 18
  Top Layer w0.5: U5.80 79.28,57.84 80.73,59.29 U9.6
G3_5: length 20.2
  Top Layer w0.5: U9.7 83.27,60.43 79.88,57.04 U5.79
G3_6: length 23.9
  Top Layer w0.5: U5.78 83.01,56.24 85.81,59.03 U9.8
G3_7: length 27.2
  Top Layer w0.5: U9.9 88.39,73.64 88.39,58.31 85.51,55.44 U5.77
G3_8: length 31.2
  Top Layer w0.5: U9.10 90.93,73.64 90.93,56.41 89.16,54.64 U5.76
G3_9: length 34.2
  Top Layer w0.5: U9.11 93.6,73.51 93.6,56.54 90.9,53.84 U5.75
G4_0: length 47.9
  Top Layer w0.5: U5.72 102.09,51.44 105.16,54.5 105.16,73.64 U7.10
G4_1: length 50.7
  Top Layer w0.5: U7.9 107.7,73.64 107.7,54.63 103.7,50.64 U5.71
G4_2: length 54.5
  Top Layer w0.5: U7.8 110.19,52.81 107.22,49.84 U5.70
G4_3: length 58.2
  Top Layer w0.5: U5.69 110.23,49.04 112.78,51.58 112.78,73.64 U7.7
G4_4: length 61.8
  Top Layer w0.5: U7.6 115.32,73.64 115.32,50.31 113.24,48.24 U5.68
G4_5: length 65.8
  Top Layer w0.5: U7.5 117.81,48.36 116.88,47.44 U5.67
G4_6: length 69.1
  Top Layer w0.5: U7.4 120.4,73.64 120.4,47.65 119.39,46.64 U5.66
G4_7: length 71.9
  Top Layer w0.5: U5.65 121,45.84 122.89,47.73 U7.3
G4_8: length 64.9
  Top Layer w0.5: U5.64 75.45,47.25 v1(75.44,47.27)
  Bottom Layer w0.5: v1(75.44,47.27) 99.01,47.27 U7.2
G4_9: length 68.5
  Top Layer w0.5: U5.63 74.65,45.64 v1(74.04,46.25)
  Bottom Layer w0.5: U7.1 100.54,46.25 v1(74.04,46.25)
HGD_1: length 37.7
  Top Layer w0.5: U5.74 94.04,53.04 95.97,54.97 U9.12
HGD_2: length 44.3
  Top Layer w0.5: U7.11 102.62,73.64 102.62,55.65 99.21,52.24 U5.73
HV: length 83.3
  Top Layer w1: D1.1 v1(8.76,51.08) ; U8.1 4.03,55.81 v1(7.97,51.87)
  Bottom Layer w1: v1(8.76,51.08) v1(7.97,51.87) 7.97,64.25 11.18,67.46 34.04,67.46 36.03,69.45 U6.12
HV_CLK: length 34
  Top Layer w0.3: v1(64.52,31.64) 64.52,31.22 62.74,29.45 OSC1.19 ; v1(58.67,53.87) 58.64,53.84 U5.30
  Bottom Layer w0.3: v1(58.67,53.87) 64.52,48.03 v1(64.52,31.64)
HV_DIN1: length 40.1
  Top Layer w0.3: v1(62.99,55.39) 62.95,55.44 U5.28 ; OSC1.14 65.24,27.93 68.33,31.01 v1(68.33,31.64)
  Bottom Layer w0.3: v1(68.33,31.64) 68.33,50.06 v1(62.99,55.39)
HV_DIN2: length 39.4
  Top Layer w0.3: v1(60.96,56.28) 60.91,56.24 U5.27 ; v1(67.56,31.64) 67.56,31.01 64.74,28.19 OSC1.15
  Bottom Layer w0.3: v1(67.56,31.64) 67.56,49.68 v1(60.96,56.28)
HV_DIN3: length 38.7
  Top Layer w0.3: v1(59.18,57.05) 59.18,57.04 U5.26 ; v1(66.8,31.64) 66.8,31.01 64.24,28.45 OSC1.16
  Bottom Layer w0.3: v1(66.8,31.64) 66.8,49.42 v1(59.18,57.05)
HV_DIN4: length 37.9
  Top Layer w0.3: U5.25 57.25,57.84 v1(57.28,57.81) ; OSC1.17 63.74,28.84 66.04,31.14 v1(66.04,31.64)
  Bottom Layer w0.3: v1(57.28,57.81) 66.04,49.04 v1(66.04,31.64)
HV_LE: length 33.1
  Top Layer w0.3: OSC1.20 62.24,30.13 v1(63.75,31.64) ; U5.29 56.64,54.64 v1(56.64,54.63)
  Bottom Layer w0.3: v1(56.64,54.63) 63.75,47.52 v1(63.75,31.64)
HV_POL: length 33.4
  Top Layer w0.3: v1(65.28,31.64) 65.28,31.14 63.24,29.1 OSC1.18 ; v1(63.75,49.93) 63.66,49.84 U5.35
  Bottom Layer w0.3: v1(65.28,31.64) 65.28,48.41 v1(63.75,49.93)
NRST: length 65.4
  Top Layer w0.3: v1(72.9,18.69) 72.65,18.94 R17.2 72.28,23 OSC1.7 ; 115.35,7.1 114.81,7.64 114.81,8.59 109.79,8.59 v1(109.73,8.66) ; 115.35,7.1 SW11.3 ; 115.35,7.1 SW11.4
  Bottom Layer w0.3: v1(109.73,8.66) 99.69,18.69 v1(72.9,18.69)
PA2/U2TX: length 55.5
  Top Layer w0.254: H2.2 v1(96.65,19.96) 105.86,29.17 U3.15
  Top Layer w0.3: v1(68.96,25.8) 68.66,25.5 OSC1.12
  Bottom Layer w0.254: v1(96.65,19.96) 96.65,20.98 91.82,25.8 v1(68.96,25.8)
PA3/U2RX: length 58.3
  Top Layer w0.254: H2.1 v1(99.19,19.96) 106.4,27.17 U3.16
  Top Layer w0.3: OSC1.13 65.74,27.66 66.8,28.72 v1(69.09,28.72)
  Bottom Layer w0.254: v1(69.09,28.72) 91.44,28.72 99.19,20.98 v1(99.19,19.96)
PA9/U1TX: length 41.4
  Top Layer w0.3: R22.2 51.93,23.01 58.74,23.01 OSC1.30 62.35,23 v1(62.74,23.39)
  Top Layer w0.5: H3.2 83.95,20.22 v1(80.77,23.39)
  Bottom Layer w0.3: v1(80.77,23.39) v1(62.74,23.39)
PA10/U1RX: length 43.3
  Top Layer w0.3: R21.2 53.08,22.5 OSC1.31 v1(62.74,22.5)
  Top Layer w0.5: v1(83.19,22.5) 86.49,19.2 H3.1
  Bottom Layer w0.3: v1(62.74,22.5) v1(83.19,22.5)
PB4: length 22.6
  Top Layer w0.254: SW10.1 SW10.2 58.38,7.1 v1(58.42,7.13) ; OSC1.40 61.74,17.68 59.2,15.13 v1(58.8,15.13)
  Bottom Layer w0.254: v1(58.42,7.13) 58.8,7.51 v1(58.8,15.13)
PB5: length 22.9
  Top Layer w0.254: SW9.2 71.78,7.13 v1(62.23,7.13) ; v1(59.94,15.13) 62.24,17.43 OSC1.41
  Bottom Layer w0.254: v1(62.23,7.13) 59.94,9.42 v1(59.94,15.13)
PB6: length 33.3
  Top Layer w0.254: v1(77.34,7.13) 86.77,7.13 SW8.2 ; v1(60.96,15.13) 62.74,16.92 OSC1.42
  Bottom Layer w0.254: v1(77.34,7.13) 68.96,7.13 v1(60.96,15.13)
PB7: length 47
  Top Layer w0.254: SW7.2 101.75,7.13 v1(92.07,7.13) ; OSC1.43 63.24,16.4 v1(61.98,15.13)
  Bottom Layer w0.254: v1(61.98,15.13) 69.09,8.02 91.19,8.02 v1(92.07,7.13)
PB12: length 5.2
  Top Layer w0.3: OSC1.25 55.84,25.5 v1(54.23,23.9)
PB13: length 4.1
  Top Layer w0.3: v1(55.12,23.77) 56.35,25 OSC1.26
PB14: length 3.1
  Top Layer w0.3: OSC1.27 56.87,24.5 v1(56.01,23.64)
PB15: length 1.9
  Top Layer w0.3: OSC1.28 57.38,24 v1(57.02,23.64)
SWCLK: length 25.1
  Top Layer w0.3: OSC1.37 60.24,17.47 59.69,16.91 53.97,16.91 v1(53.09,17.8)
  Bottom Layer w0.3: v1(53.09,17.8) 53.09,23.9 52.32,24.66 H1.3
SWDIO: length 21.2
  Top Layer w0.3: v1(52.32,20.34) 52.99,21 OSC1.34
  Bottom Layer w0.3: H1.4 49.78,22.88 v1(52.32,20.34)
USB1CC1: length 2.3
  Top Layer w0.3: 10.04,8.15 9.78,8.15 9.42,8.51 USB1.A5
USB1CC2: length 2.7
  Top Layer w0.3: USB1.B5 9.3,5.51 10.04,6.25 10.04,6.5
USB1D+: length 41.8
  Top Layer w0.3: USB1.B6 8.82,6.51 9,6.69 v1(9,7.28) 8.77,7.51 USB1.A6 ; U4.1 v1(39.5,22.75)
  Bottom Layer w0.3: v1(9,7.28) 9.55,7.28 25.02,22.75 v1(39.5,22.75)
USB1D-: length 46.3
  Top Layer w0.3: USB1.A7 6.73,7.01 6.48,7.26 v1(6.48,7.77) 6.72,8.01 USB1.B7 ; U4.2 v1(39.5,21.48)
  Bottom Layer w0.3: v1(6.48,7.77) 6.48,6.75 7.37,5.86 9.02,5.86 24.64,21.48 v1(39.5,21.48)
VIPN: length 34.5
  Top Layer w0.3: 14.1,4.72 14.11,4.71 ; 14.1,4.72 14.1,8.53 13.12,9.51 USB1.B9 ; 14.1,4.72 13.81,5.01 USB1.B4 ; 14.11,4.71 SW1.3 ; 14.11,4.71 7.88,4.71 ; USB1.A4 13.2,9.81 14.35,8.66 14.35,4.47
$2N14740: length 2.1
  Top Layer w1: 3.3V指示灯.2 R11.2
$2N61129: length 4
  Top Layer w0.69: 22.4,9.18 22.35,9.23 U1.1 ; 22.4,9.18 22.41,9.17 ; 22.4,9.18 R1.1
$2N61132: length 2.5
  Top Layer w0.69: U1.3 24.89,10.55 26.1,9.34 C8.2
$2N61133: length 2
  Top Layer w0.69: R4.2 27.93,8.86 C8.1
$2N61134: length 1.7
  Top Layer w0.69: R5.2 26.17,11.32 U1.4
$2N61136: length 2.2
  Top Layer w0.69: C7.1 23.62,18.42 U1.7
$2N61143: length 3.7
  Top Layer w0.3: U1.5 26.3,17.29 C10.2 28,15.57 R9.1
$2N61144: length 1.7
  Top Layer w0.69: R6.1 U1.6
$2N61146: length 2.1
  Top Layer w1: R2.2 R3.1
$2N61148: length 8.1
  Top Layer w0.3: R9.2 31.11,17.18 31.11,20.55 R10.2
$2N61152:
  vias: v2(3.02,33.8) v2(3.02,31.8) v2(3.02,29.8) v2(3.02,27.8) v2(5.02,33.8) v2(5.02,31.8) v2(5.02,29.8) v2(5.02,27.8) v2(7.02,33.8) v2(7.02,31.8) v2(7.02,29.8) v2(7.02,27.8) v2(9.02,31.8) v2(9.02,29.8) v2(9.02,27.8) v2(11.02,33.8) v2(11.02,31.8) v2(11.02,29.8) v2(11.02,27.8) v2(13.02,33.8) v2(13.02,31.8) v2(13.02,29.8) v2(13.02,27.8)
$2N61153:
  vias: v1(18.4,33.59) v1(18.4,31.59) v1(18.4,29.59) v1(20.4,33.59) v1(20.4,31.59) v1(20.4,29.59) v1(22.4,33.59) v1(24.4,33.59) v1(26.4,33.59)
$2N62507: length 2.3
  Top Layer w1: C4.1 C9.2
$4N23212: length 2.6
  Top Layer w0.5: R15.2 84.84,34.31 U10.3
$4N37986: length 2.2
  Top Layer w0.3: U4.7 R22.1
$4N37987: length 2.3
  Top Layer w0.3: R21.1 48.52,20.22 46.75,20.22
$4N48239: length 33.8
  Top Layer w0.5: B1.1 96.39,41.17 94.49,43.08 79.12,43.08 77.6,41.55 77.6,37.36 74.55,34.31 U10.14 70.67,34.31 C20.2
$4N60541: length 2.4
  Top Layer w0.5: U3.3 127.66,31.17 R16.1
$4N60605: length 2.4
  Top Layer w0.5: R19.1 110.21,39.27 U3.10
$4N60656: length 11
  Top Layer w0.5: U3.12 110.27,35.2 106.68,35.2 105.41,36.47 R20.2
$7N2158: length 45.4
  Top Layer w0.5: U5.40 52.39,45.84 D2.1
  Top Layer w1: R25.1 48.67,49.42 D2.1

## Copper pours and planes (outline as drawn; the poured copper is in the pictures)
GND on Top Layer: 25.53,24.03 35.31,33.8 35.31,42.69 36.83,44.22 131.06,44.22 135.51,39.77 135.51,-2.26 130.81,-6.96 1.02,-6.96 -5.59,-0.36 -5.59,20.34 -1.91,24.03
GND on Bottom Layer: 35.31,42.69 36.83,44.22 131.06,44.22 135.51,39.77 135.51,-2.26 130.81,-6.96 1.02,-6.96 -5.59,-0.36 -5.59,20.34 -1.91,24.03 29.08,24.03 35.31,30.25
$2N61145 on Top Layer: 22.35,24.41 22.1,24.15 22.1,21.1 22.35,20.85 23.75,20.85 24.13,20.47 24.13,20.06 24.35,19.83 25.4,19.83 25.53,19.96 25.53,21.36 25.15,21.74 25.15,23.53 24.8,23.88 24.8,24.12 24.51,24.41
$2N61148 on Top Layer: 25.78,24.15 25.4,23.77 25.4,22.12 26.54,20.98 29.97,20.98 30.48,21.48 30.48,23.77 30.1,24.15
$2N61152 on Top Layer: 1.02,35.2 15.62,35.2 15.62,24.79 1.02,24.79
$2N61152 on Bottom Layer: 1.02,45.87 15.62,45.87 15.62,24.79 1.02,24.79
$2N61153 on Top Layer: 16.26,35.2 28.19,35.2 28.19,24.79 16.26,24.79
$2N61153 on Bottom Layer: 16.26,35.2 28.19,35.2 28.19,25.93 16.26,25.93

## Text on the board
Top Silkscreen Layer: GND/5V/U1TX/U1RX | GND/5V/TX2/RX2 | SWDIO/SWCLK/GND/VCC | 高压危险，请勿触碰
